# Altium schematic sheet Block Diagram.SchDoc: Wireless Security Detector
size A3; Date: 13.10.20221; ApprovedBy: Kağan KALAYLI; CheckedBy: Kağan KALAYLI; Author: Kağan KALAYLI; CompanyName: Izmir Katip Celebi University; DrawnBy: Kağan KALAYLI; Engineer: Kağan KALAYLI; Organization: Izmir Katip Celebi University; DocumentNumber: 2; Revision: 1.1; SheetNumber: 2; SheetTotal: 5; ENG_APP_DATE: --/--/--; DSN_APP_DATE: --/--/--; CHK_APP_DATE: --/--/--; Time: 11:00
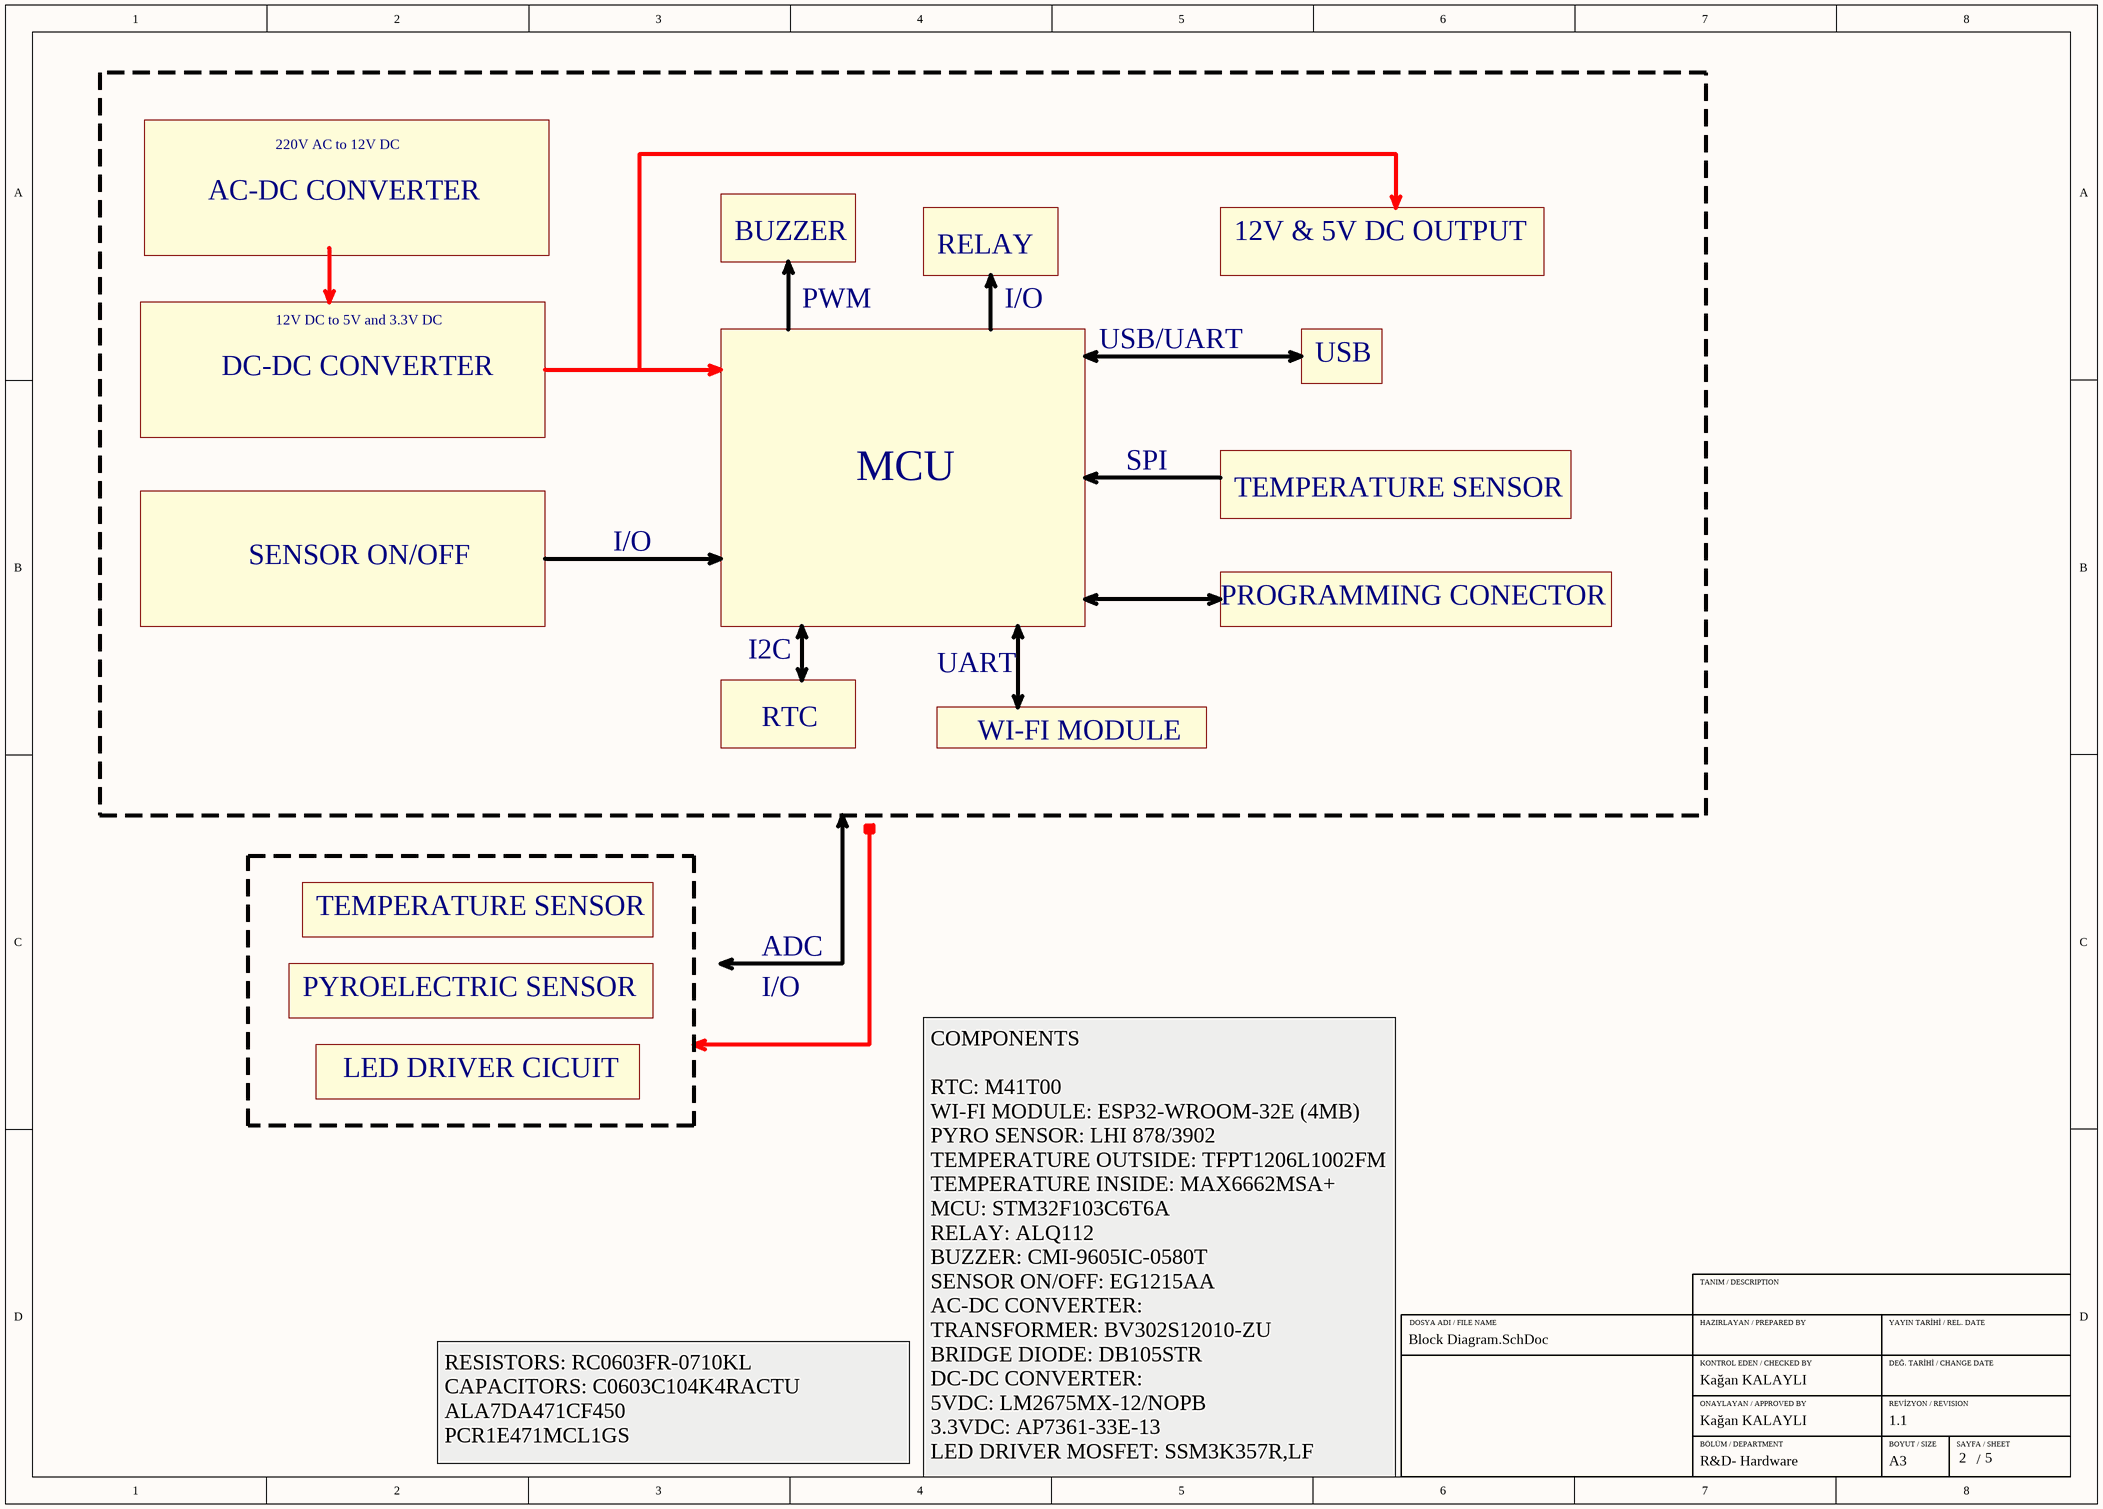
[diagram p0: Block Diagram.SchDoc]

## Notes on the sheet
- 220V AC to 12V DC
- AC-DC CONVERTER
- BUZZER
- 12V & 5V DC OUTPUT
- PWM
- RELAY
- I/O
- DC-DC CONVERTER
- 12V DC to 5V and 3.3V DC
- USB/UART
- USB
- MCU
- SPI
- TEMPERATURE SENSOR
- SENSOR ON/OFF
- PROGRAMMING CONECTOR
- I2C
- UART
- RTC
- WI-FI MODULE
- ADC
- PYROELECTRIC SENSOR
- LED DRIVER CICUIT
- RESISTORS: RC0603FR-0710KL
  CAPACITORS: C0603C104K4RACTU
  ALA7DA471CF450
  PCR1E471MCL1GS
- COMPONENTS
  RTC: M41T00
  WI-FI MODULE: ESP32-WROOM-32E (4MB)
  PYRO SENSOR: LHI 878/3902
  TEMPERATURE OUTSIDE: TFPT1206L1002FM
  TEMPERATURE INSIDE: MAX6662MSA+
  MCU: STM32F103C6T6A
  RELAY: ALQ112
  BUZZER: CMI-9605IC-0580T
  SENSOR ON/OFF: EG1215AA
  AC-DC CONVERTER:
  TRANSFORMER: BV302S12010-ZU
  BRIDGE DIODE: DB105STR
  DC-DC CONVERTER:
  5VDC: LM2675MX-12/NOPB
  3.3VDC: AP7361-33E-13
  LED DRIVER MOSFET: SSM3K357R,LF
- DOSYA ADI / FILE NAME
- HAZIRLAYAN / PREPARED BY
- TANIM / DESCRIPTION
- YAYIN TARİHİ / REL. DATE
- KONTROL EDEN / CHECKED BY
- DEĞ. TARİHİ / CHANGE DATE
- ONAYLAYAN / APPROVED BY
- BÖLÜM / DEPARTMENT
- BOYUT / SIZE
- REVİZYON / REVISION
- SAYFA / SHEET
- /
- R&D- Hardware
- A3